# EAGLE design SparkFun Fuse Breakout Board (EAGLE 9.5.0)
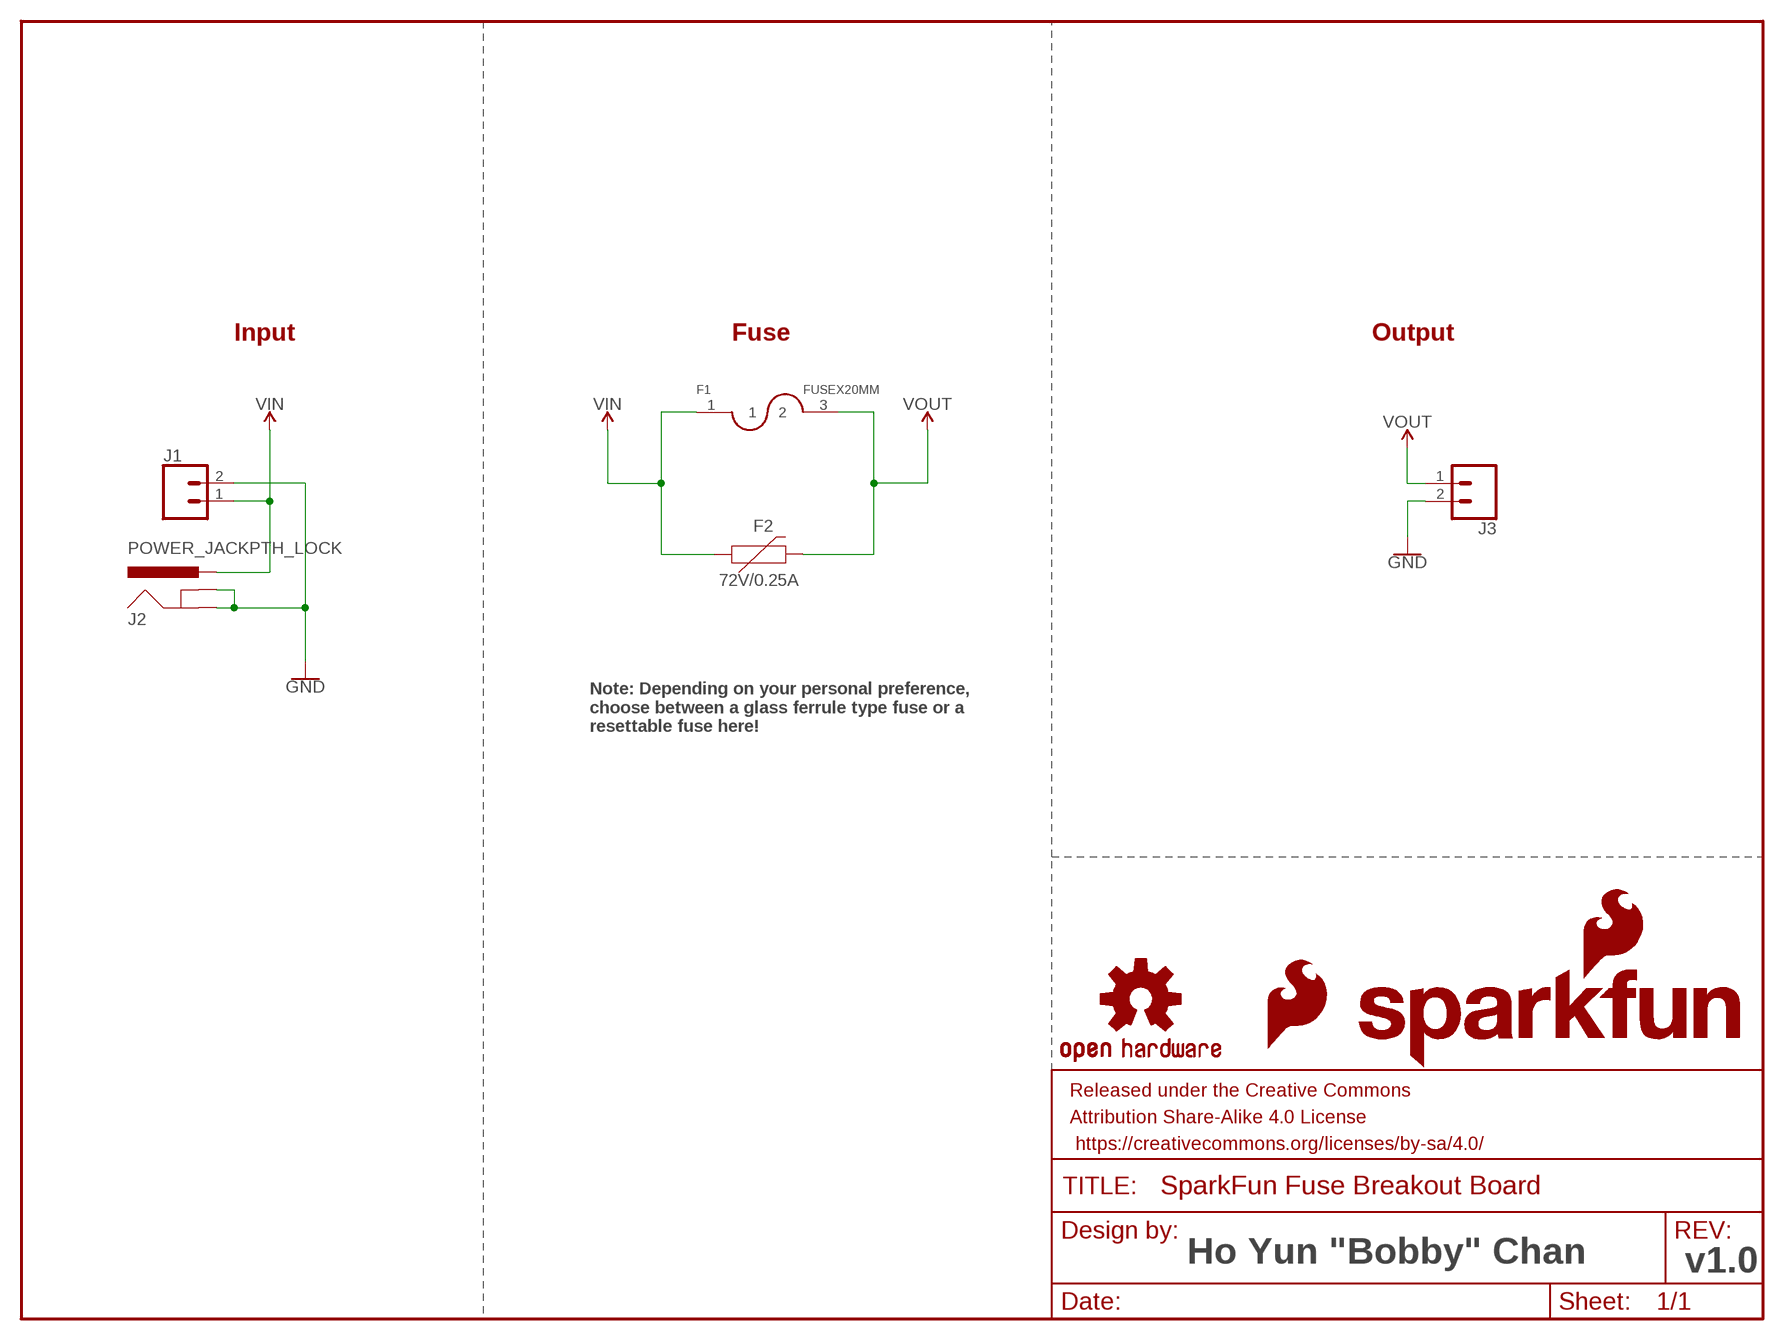
[diagram p0: schematic, sheet 1]

## Parts
F1  FUSEX20MM  [FUSE_5MM]
F2  72V/0.25A  PPTC_PTH  [PTH]
FRAME1  FRAME-LETTER  [CREATIVE_COMMONS]
J1  CONN_025MM  [SCREWTERMINAL-5MM-2]
J2  POWER_JACKPTH_LOCK  [POWER_JACK_PTH_LOCK]
J3  CONN_025MM  [SCREWTERMINAL-5MM-2]
LOGO1  SFE_LOGO_NAME_FLAME.1_INCH  [SFE_LOGO_NAME_FLAME_.1]
LOGO2  SFE_LOGO_FLAME.1_INCH  [SFE_LOGO_FLAME_.1]
LOGO3  OSHW-LOGOMINI  [OSHW-LOGO-MINI]

## Nets
GND: J1.2 J2.GND J2.GNDBREAK J3.2
VIN: F1.1 F2.P$1 J1.1 J2.PWR
VOUT: F1.3 F2.P$2 J3.1

## Notes on the sheet
- Input | Fuse | Output
- Note: Depending on your personal preference,
  choose between a glass ferrule type fuse or a
  resettable fuse here!
- Ho Yun "Bobby" Chan | v1.0

## Library data of the parts
F1 = SparkFun:FUSE
F2 = SparkFun-Fuses:PPTC: Resettable Fuse PPTC Resettable Fuse. Really a sort of resistor with a polymeric positive temperature coefficient whose resistance increases dramatically with an increase in temperature. When heated by the power passing through the resistance rises causing the current to be limited, protecting the circuit. This is achieved by the transition of the polymer from a crystalline to an amorphous state where the conductive carbon separates breaking the conductive pathways found in the cool crystalline structure. When a PPTC cools back down it resumes conducting letting the circuit turn back on. SparkFun Products: SparkFun RedBoard - Programmed with Arduino <https://www.sparkfun.com/products/12757> Pro Micro - 5V/16MHz <https://www.sparkfun.com/products/12640> Arduino Pro 328 - 5V/16MHz <https://www.sparkfun.com/products/10915> MP3 Trigger <https://www.sparkfun.com/products/13720>; PROD_ID: RES-08490
FRAME1 = SparkFun-Aesthetics:FRAME-LETTER: Schematic Frame - Letter Standard 8.5x11 US Letter frame
J1 J3 = SparkFun-Connectors:CONN_02: Multi connection point. Often used as Generic Header-pin footprint for 0.1 inch spaced/style header connections On any of the 0.1 inch spaced packages, you can populate with these: Break Away Headers - Straight <https://www.sparkfun.com/products/116> (PRT-00116) Break Away Male Headers - Right Angle <https://www.sparkfun.com/products/553> (PRT-00553) Female Headers <https://www.sparkfun.com/products/115> (PRT-00115) Break Away Headers - Machine Pin <https://www.sparkfun.com/products/117> (PRT-00117) Break Away Female Headers - Swiss Machine Pin <https://www.sparkfun.com/products/743> (PRT-00743) For SCREWTERMINALS and SPRING TERMINALS visit here: Screw Terimnals on SparkFun.com <https://www.sparkfun.com/search/results?term=Screw+Terminals> (5mm/3.5mm/2.54mm spacing) This device is also useful as a general connection point to wire up your design to another part of your project. Our various solder wires solder well into these plated through hole pads. Hook-Up Wire - Assortment (Stranded, 22 AWG) <https://www.sparkfun.com/products/11375> (PRT-11375) Hook-Up Wire - Assortment (Solid Core, 22 AWG) <https://www.sparkfun.com/products/11367> (PRT-11367) View the entire wire category on our website here <https://www.sparkfun.com/categories/141> Special notes: Molex polarized connector foot print use with: PRT-08233 with associated crimp pins and housings. 2.54_SCREWTERM for use with PRT-10571. 3.5mm Screw Terminal footprints for PRT-08084 5mm Screw Terminal footprints for use with PRT-08432; SF_SKU: PRT-08432
J2 = SparkFun-Connectors:POWER_JACK: Power Jack Connector This is the standard 5.5mm barrel jack for power. The PTH is the most common, proven, reliable, footprint. The Slot footprint only works if the mill layer is transmitted to the PCB fab house so be warned. Here are the connectors we sell at SparkFun: DC Barrel Power Jack/Connector <https://www.sparkfun.com/products/119> (PRT-00119) DC Barrel Power Jack/Connector (SMD) <https://www.sparkfun.com/products/12748> (PRT-12748) DC Barrel Jack Adapter - Breadboard Compatible <https://www.sparkfun.com/products/10811> (PRT-10811) It is used on this SparkFun product (and many, many others): SparkFun RedBoard - Programmed with Arduino <https://www.sparkfun.com/products/12757> (DEV-12757) Also, if you need a mating power supply or connector, please check these out: Wall Adapter Power Supply - 9VDC 650mA <https://www.sparkfun.com/products/298> (TOL-00298) DC Barrel Jack Adapter - Male <https://www.sparkfun.com/products/10287> (PRT-10287); PROD_ID: CONN-08197; SF_ID: PRT-00119
LOGO1 = SparkFun-Aesthetics:SFE_LOGO_NAME_FLAME: SparkFun Font Logo w/ Flame This is the SparkFun full logo. The logo on the schematic will always be the same size; the package variant is the height of the flame part of the logo. Default layer for the logo on the board is tSilk.
LOGO2 = SparkFun-Aesthetics:SFE_LOGO_FLAME: SparkFun Flame Logo This is the SparkFun flame logo. The logo on the schematic will always be the same size; the package variant is the height of the flame. Default layer for the logo on the board is tSilk.
LOGO3 = SparkFun-Aesthetics:OSHW-LOGO: Open-Source Hardware (OSHW) Logo This logo indicates the piece of hardware it is found on incorporates a OSHW license and/or adheres to the definition of open source hardware found here: http://freedomdefined.org/OSHW

## Board
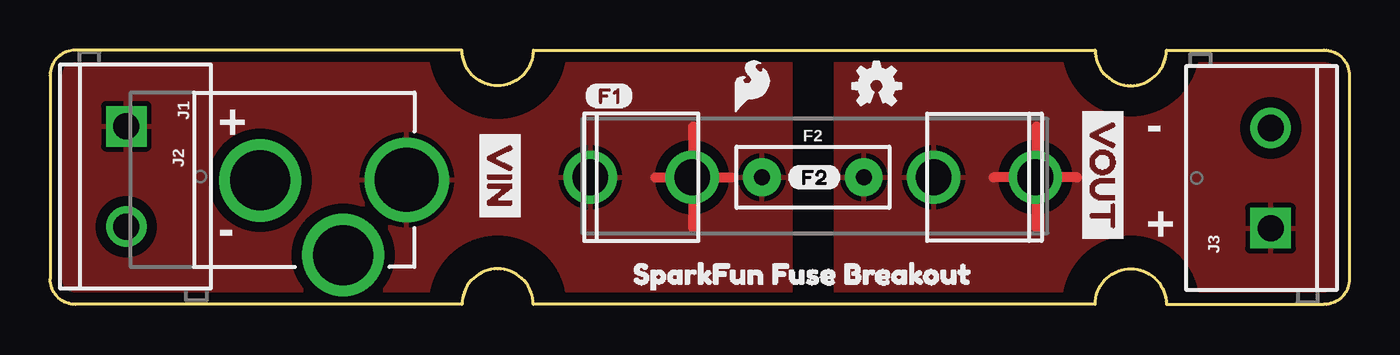
[diagram p1: board, top side]
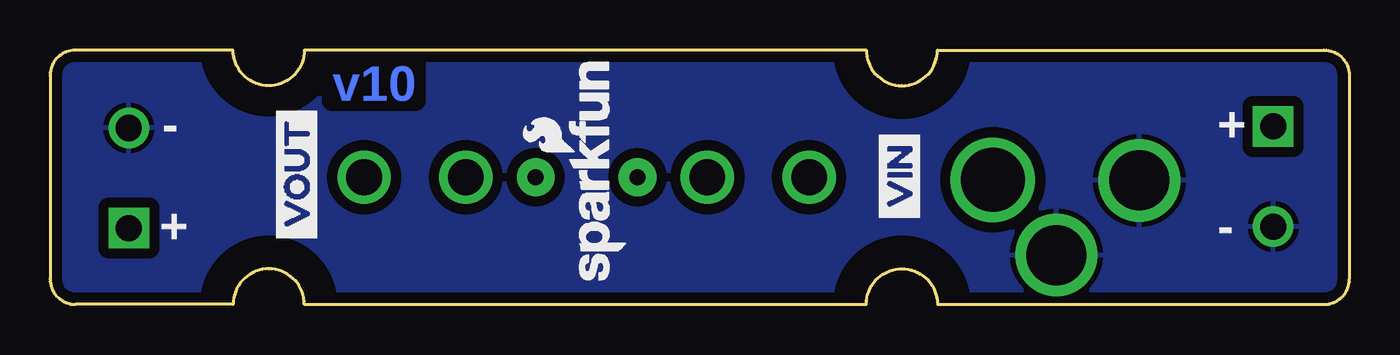
[diagram p2: board, bottom side, seen from below]

Size 64.9 x 12.7 mm. Coordinates in mm from the lower left corner, seen from the top.
Outline: 24.13,12.7 52.2,12.7 arc90 53.98,10.92 arc90 55.75,12.7 63.63,12.7 arc-90 64.9,11.43 64.9,1.27 arc-90 63.63,0 55.75,0 arc90 53.98,1.78 arc90 52.2,0 24.13,0 arc90 22.35,1.78 arc90 20.57,0 1.27,0 arc-90 0,1.27 0,11.43 arc-90 1.27,12.7 20.57,12.7 arc90 22.35,10.92 arc90 24.13,12.7
Copper layers (1*16): Top 0.035mm / dielectric 1.5mm / Bottom 0.035mm
Design rules "SparkFun-2-layer-STANDARD": minimum track width 10mil, minimum drill 20mil, track to track 10mil, track to pad 8mil, pad to pad 8mil, via to via 10mil, smd to smd 8mil, copper to edge 8mil, drill to drill 8mil, minimum pad ring 10mil, minimum via ring 10mil, stop-mask expansion 4mil, vias tented up to drill 25mil, thermal gap 10mil
tRestrict: area 19.5,-2.8 to 25.2,2.8; area 19.5,9.9 to 25.2,15.5; area 51.1,10 to 56.8,15.7; area 51.1,-2.8 to 56.8,2.8
bRestrict: area 19.5,9.9 to 25.2,15.5; area 19.5,-2.8 to 25.2,2.8; area 51.1,10 to 56.8,15.7; area 51.1,-2.8 to 56.8,2.8

### Footprints (pad centres in the part's own frame; a part is rotated, then mirrored left to right if it is on the bottom)
FUSE_5MM = drill 1.778: 1 0,-11.113; 2 0,-6.032; 3 0,6.032; 4 0,11.113
PTH = drill 0.8 pad 1.88: P$1 -2.54,0; P$2 2.54,0
SCREWTERMINAL-5MM-2 = drill 1.3 pad 2.032 square: 1 0,0 | drill 1.3 pad 2.032: 2 5,0
POWER_JACK_PTH_LOCK = drill 2.997 pad 4.115: GND 0.025,6.557; GNDBREAK 3.762,10.7 | drill 3.2 pad 4.115: PWR 0,13.878

### Placement (x,y rotation side)
F1  38.1,6.35 270 top
F2  38.1,6.35 0 top
FRAME1  12.06,-24.13 0 top  (outside the outline)
J1  3.81,8.89 270 top
J2  3.94,6.22 270 top
J3  60.96,3.81 90 top
LOGO1  36.07,0.76 90 bottom
LOGO2  33.91,9.27 0 top
LOGO3  41.27,10.92 0 top
U$1  [VIN0]  22.48,9.14 270 top
U$2  [VOUT0]  52.58,10.29 270 top
U$3  [VOUT0]  52.58,2.67 90 bottom
U$4  [VIN0]  22.48,3.68 90 bottom
U$11  [SPARKFUN_FUSE_BREAKOUT0]  28.19,1.52 0 top
U$28  [F10]  26.67,10.41 0 top
U$29  [F20]  36.83,6.35 0 top

### Tracks (layer width: path | path; a pad name or v marks a point on that pad's centre or on a via)
GND
  pour Bottom (isolate 0.508): 52.2,12.7 24.13,12.7 arc-90 22.35,10.92 arc-90 20.57,12.7 1.27,12.7 arc90 0,11.43 0,1.27 arc90 1.27,0 20.57,0 arc-90 22.35,1.78 arc-90 24.13,0 52.2,0 arc-90 53.98,1.78 arc-90 55.75,0 63.63,0 arc90 64.9,1.27 64.9,11.43 arc90 63.63,12.7 55.75,12.7 arc-90 53.98,10.92 arc-90
VIN
  Top 0.508: 32.13,3.81 32.13,8.89 | 30.23,6.35 34.04,6.35
  pour Top (isolate 0.508): 36.96,0 1.27,0 arc-90 0,1.27 0,11.43 arc-90 1.27,12.7 36.96,12.7
VOUT
  Top 0.508: 51.31,6.35 47.12,6.35 | 49.28,3.81 49.28,8.89
  pour Top (isolate 0.508): 39.24,0 63.5,0 arc90 64.77,1.27 64.77,11.43 arc90 63.5,12.7 39.24,12.7

### Text on the board
Bottom: v10
tPlace: + | - | - | +
bPlace: + | - | - | +
Measures: Dimensions are given in inches.
tDocu: Ho Yun "Bobby" Chan